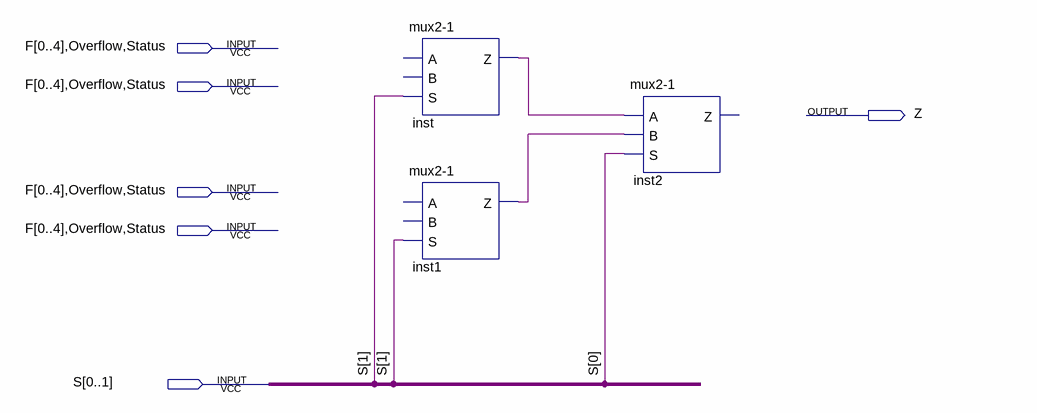
[diagram p0: schematic sheet]
// Quartus schematic mux4-1-vetor.bdf as structural Verilog: 3 symbols, 6 pins
module \mux4-1-vetor  (
  input  [4:0] F,
  input  Overflow,
  input  Status,
  input  [0:1] S,
  output Z
);

  wire inst1_z, inst_z;

  \mux2-1  inst (.S(S[1]), .Z(inst_z));  // open: A, B
  \mux2-1  inst1 (.S(S[1]), .Z(inst1_z));  // open: A, B
  \mux2-1  inst2 (.A(inst_z), .B(inst1_z), .S(S[0]));  // open: Z
endmodule
